# EAGLE design LoRa Gateway ESP32 - DRAFT 3 (EAGLE 9.4.2)
COMPANY: ADAFRUIT INDUSTRIES; DRAWN: KTOWN; REV: B

## Sheet 1 of 2: ESP
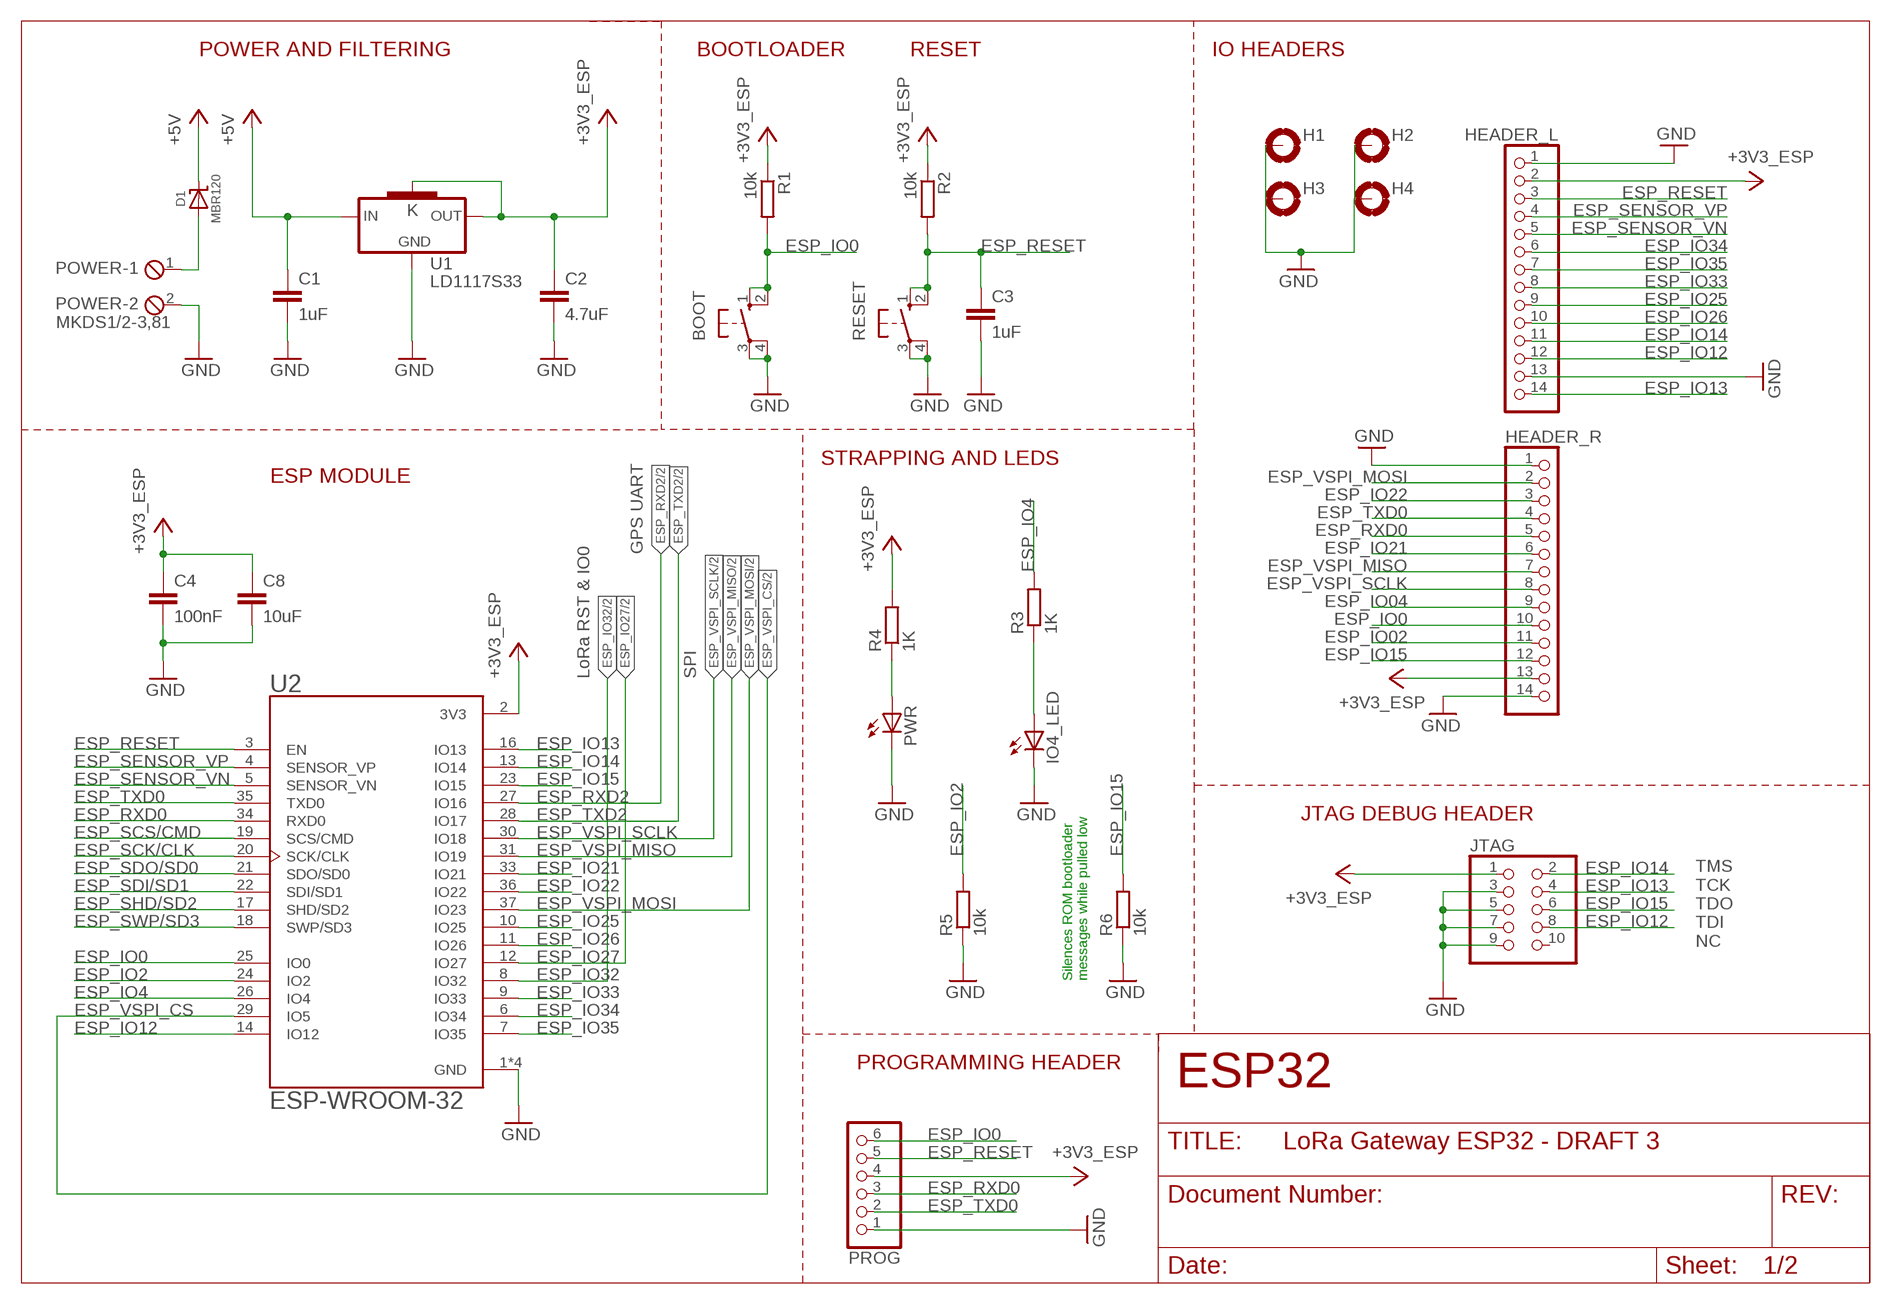
[diagram p0: schematic, sheet 1]

### Parts
BOOT  10-XX  [B3F-10XX]
C1  1uF  C-EUC0805K  [C0805K]
C2  4.7uF  C-EUC0805K  [C0805K]
C3  1uF  C-EUC0805K  [C0805K]
C4  100nF  C-EUC0805K  [C0805K]
C8  10uF  C-EUC0805K  [C0805K]
D1  MBR120  DIODE-SCHOTTKYSOD-123  [SOD-123]
H1  MOUNT-PAD-ROUND3.2  [3,2-PAD]
H2  MOUNT-PAD-ROUND3.2  [3,2-PAD]
H3  MOUNT-PAD-ROUND3.2  [3,2-PAD]
H4  MOUNT-PAD-ROUND3.2  [3,2-PAD]
HEADER_L  PINHD-1X14  [1X14]
HEADER_R  PINHD-1X14  [1X14]
IO4_LED  LEDCHIP-LED0805  [CHIP-LED0805]
JTAG  PINHD-2X5  [2X05]
POWER  MKDS1/2-3,81  [2POL381]
PROG  PINHD-1X6  [1X06]
PWR  LEDCHIP-LED0805  [CHIP-LED0805]
R1  10k  R-EU_R0805  [R0805]
R2  10k  R-EU_R0805  [R0805]
R3  1K  R-EU_R0805  [R0805]
R4  1K  R-EU_R0805  [R0805]
R5  10k  R-EU_R0805  [R0805]
R6  10k  R-EU_R0805  [R0805]
RESET  10-XX  [B3F-10XX]
U1  LD1117S33  [SOT223]
U2  ESP-WROOM-32  [MODULE_ESP-WROOM-32]

### Nets
+3V3_ESP: C2.1 C4.1 C8.1 HEADER_L.2 HEADER_R.13 JTAG.1 PROG.4 R1.1 R2.1 R4.2 U1.2(OUT) U1.4(K) U2.2(3V3) ; also sheet 2
+5V: C1.1 D1.C U1.3(IN)
ESP_IO0: BOOT.1(S) BOOT.2(S1) HEADER_R.10 PROG.6 R1.2 U2.25(IO0)
ESP_IO2: R5.2 U2.24(IO2)
ESP_IO02: HEADER_R.11
ESP_IO4: R3.2 U2.26(IO4)
ESP_IO04: HEADER_R.9
ESP_IO12: HEADER_L.12 JTAG.8 U2.14(IO12)
ESP_IO13: HEADER_L.14 JTAG.4 U2.16(IO13)
ESP_IO14: HEADER_L.11 JTAG.2 U2.13(IO14)
ESP_IO15: HEADER_R.12 JTAG.6 R6.2 U2.23(IO15)
ESP_IO21: HEADER_R.6 U2.33(IO21)
ESP_IO22: HEADER_R.3 U2.36(IO22)
ESP_IO25: HEADER_L.9 U2.10(IO25)
ESP_IO26: HEADER_L.10 U2.11(IO26)
ESP_IO27: U2.12(IO27) ; also sheet 2
ESP_IO32: U2.8(IO32) ; also sheet 2
ESP_IO33: HEADER_L.8 U2.9(IO33)
ESP_IO34: HEADER_L.6 U2.6(IO34)
ESP_IO35: HEADER_L.7 U2.7(IO35)
ESP_RESET: C3.1 HEADER_L.3 PROG.5 R2.2 RESET.1(S) RESET.2(S1) U2.3(EN)
ESP_RXD0: HEADER_R.5 PROG.3 U2.34(RXD0)
ESP_RXD2: U2.27(IO16) ; also sheet 2
ESP_SCK/CLK: U2.20(SCK/CLK)
ESP_SCS/CMD: U2.19(SCS/CMD)
ESP_SDI/SD1: U2.22(SDI/SD1)
ESP_SDO/SD0: U2.21(SDO/SD0)
ESP_SENSOR_VN: HEADER_L.5 U2.5(SENSOR_VN)
ESP_SENSOR_VP: HEADER_L.4 U2.4(SENSOR_VP)
ESP_SHD/SD2: U2.17(SHD/SD2)
ESP_SWP/SD3: U2.18(SWP/SD3)
ESP_TXD0: HEADER_R.4 PROG.2 U2.35(TXD0)
ESP_TXD2: U2.28(IO17) ; also sheet 2
ESP_VSPI_CS: U2.29(IO5) ; also sheet 2
ESP_VSPI_MISO: HEADER_R.7 U2.31(IO19) ; also sheet 2
ESP_VSPI_MOSI: HEADER_R.2 U2.37(IO23) ; also sheet 2
ESP_VSPI_SCLK: HEADER_R.8 U2.30(IO18) ; also sheet 2
GND: BOOT.3(P) BOOT.4(P1) C1.2 C2.2 C3.2 C4.2 C8.2 H1.B3,2(MOUNT) H2.B3,2(MOUNT) H3.B3,2(MOUNT) H4.B3,2(MOUNT) HEADER_L.1 HEADER_L.13 HEADER_R.1 HEADER_R.14 IO4_LED.C JTAG.3 JTAG.5 JTAG.7 JTAG.9 POWER.2 PROG.1 PWR.C R5.1 R6.1 RESET.3(P) RESET.4(P1) U1.1(GND) U2.1(GND) U2.1.1(GND) U2.15(GND) U2.38(GND) ; also sheet 2
N$2: D1.A POWER.1
N$5: IO4_LED.A R3.1
N$10: PWR.A R4.1
Unconnected: JTAG.10

### Notes on the sheet
- POWER AND FILTERING | BOOTLOADER | RESET | IO HEADERS
- STRAPPING AND LEDS
- ESP MODULE
- GPS UART
- LoRa RST & IO0 | SPI
- JTAG DEBUG HEADER
- TMS
  TCK
  TDO
  TDI
  NC
- Silences ROM bootloader
  messages while pulled low
- PROGRAMMING HEADER
- ESP32

## Sheet 2 of 2: Lora and GPS
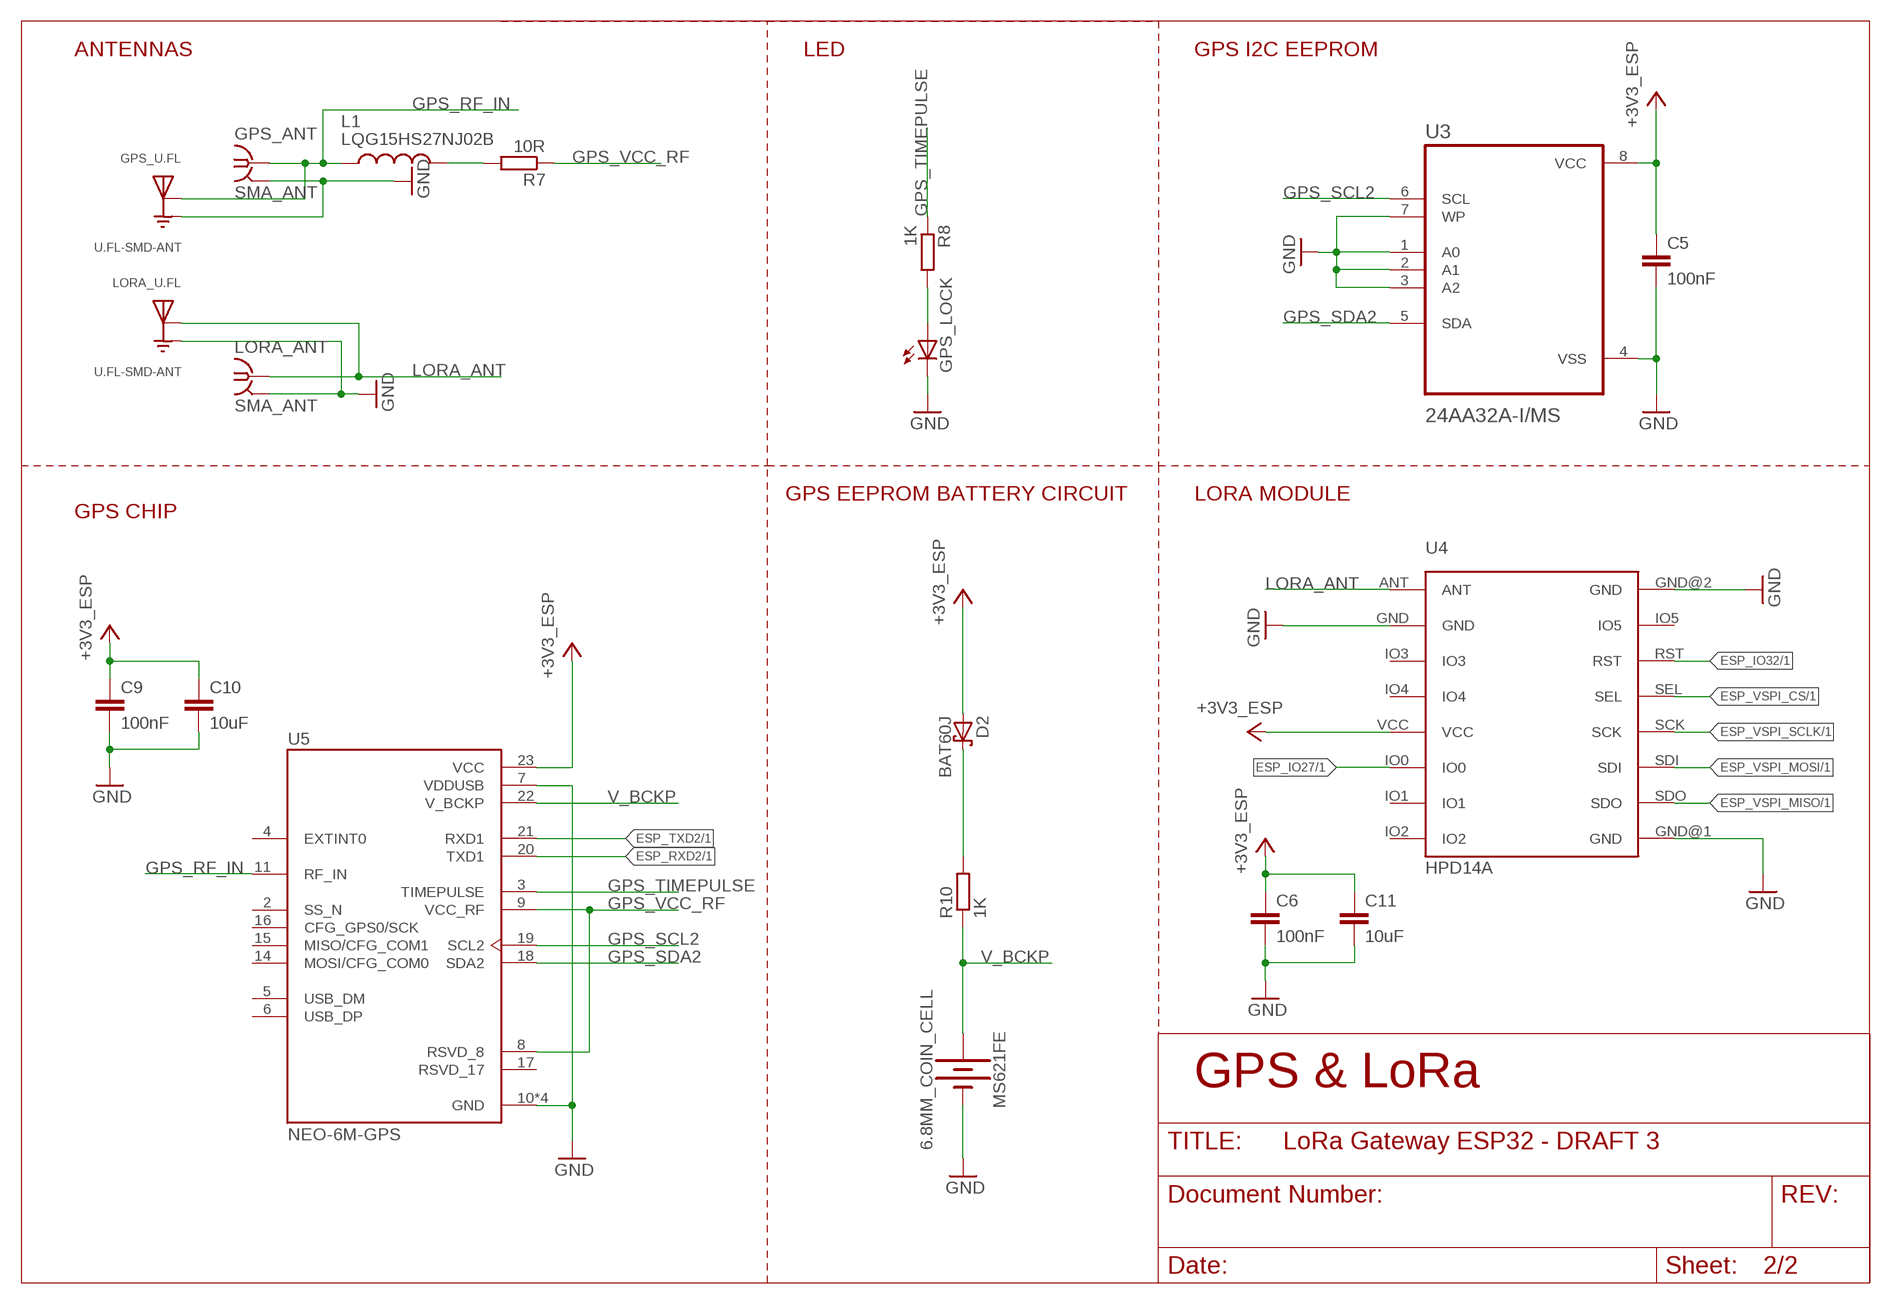
[diagram p1: schematic, sheet 2]

### Parts
C5  100nF  C-EUC0805K  [C0805K]
C6  100nF  C-EUC0805K  [C0805K]
C9  100nF  C-EUC0805K  [C0805K]
C10  10uF  C-EUC0805K  [C0805K]
C11  10uF  C-EUC0805K  [C0805K]
D2  BAT60J  [SOD323_ST]
GPS_ANT  SMA_ANT  [BU-SMA-H]
GPS_LOCK  LEDCHIP-LED0805  [CHIP-LED0805]
GPS_U.FL  U.FL-SMD-ANT  [HRS_U.FL-R-SMT-1(10)]
L1  LQG15HS27NJ02B  [INDC1005X55N]
LORA_ANT  SMA_ANT  [BU-SMA-H]
LORA_U.FL  U.FL-SMD-ANT  [HRS_U.FL-R-SMT-1(10)]
MS621FE  6.8MM_COIN_CELL  BATTERY-6.8MM_SMD  [BATTCON-6.8MM]
R7  10R  R-EU_R0805  [R0805]
R8  1K  R-EU_R0805  [R0805]
R10  1K  R-EU_R0805  [R0805]
U3  24AA32A-I/MS  [SOP65P490X110-8N]
U4  HPD14A  [HPD14A]
U5  NEO-6M-GPS  [XCVR_NEO-6M-GPS]

### Nets
+3V3_ESP: C5.1 C6.1 C9.1 C10.1 C11.1 D2.A U3.8(VCC) U4.VCC U5.23(VCC) ; also sheet 1
ESP_IO27: U4.IO0 ; also sheet 1
ESP_IO32: U4.RST ; also sheet 1
ESP_RXD2: U5.20(TXD1) ; also sheet 1
ESP_TXD2: U5.21(RXD1) ; also sheet 1
ESP_VSPI_CS: U4.SEL ; also sheet 1
ESP_VSPI_MISO: U4.SDO ; also sheet 1
ESP_VSPI_MOSI: U4.SDI ; also sheet 1
ESP_VSPI_SCLK: U4.SCK ; also sheet 1
GND: C5.2 C6.2 C9.2 C10.2 C11.2 GPS_ANT.2 GPS_ANT.3 GPS_ANT.4 GPS_ANT.5 GPS_LOCK.C GPS_U.FL.1(GND) GPS_U.FL.3(GND) LORA_ANT.2 LORA_ANT.3 LORA_ANT.4 LORA_ANT.5 LORA_U.FL.1(GND) LORA_U.FL.3(GND) MS621FE.- U3.1(A0) U3.2(A1) U3.3(A2) U3.4(VSS) U3.7(WP) U4.GND U4.GND@1(GND) U4.GND@2(GND) U5.7(VDDUSB) U5.10(GND) U5.12(GND) U5.13(GND) U5.24(GND) ; also sheet 1
GPS_RF_IN: GPS_ANT.1 GPS_U.FL.2(SIG) L1.1 U5.11(RF_IN)
GPS_SCL2: U3.6(SCL) U5.19(SCL2)
GPS_SDA2: U3.5(SDA) U5.18(SDA2)
GPS_TIMEPULSE: R8.1 U5.3(TIMEPULSE)
GPS_VCC_RF: R7.1 U5.8(RSVD_8) U5.9(VCC_RF)
LORA_ANT: LORA_ANT.1 LORA_U.FL.2(SIG) U4.ANT
N$14: GPS_LOCK.A R8.2
N$16: L1.2 R7.2
N$17: D2.C R10.2
V_BCKP: MS621FE.+ R10.1 U5.22(V_BCKP)
Unconnected: U4.IO1 U4.IO2 U4.IO3 U4.IO4 U4.IO5 U5.2(SS_N) U5.4(EXTINT0) U5.5(USB_DM) U5.6(USB_DP) U5.14(MOSI/CFG_COM0) U5.15(MISO/CFG_COM1) U5.16(CFG_GPS0/SCK) U5.17(RSVD_17)

### Notes on the sheet
- ANTENNAS | LED | GPS I2C EEPROM
- GPS EEPROM BATTERY CIRCUIT | LORA MODULE
- GPS CHIP
- GPS & LoRa

## Library data of the parts
BOOT RESET = LoRa Gateway ESP32 - DRAFT 2 VARIANT 2:10-XX: OMRON SWITCH; MPN: B3F-1000; OC_FARNELL: 176432; OC_NEWARK: 36M3542
C1-C6 C8-C11 = LoRa Gateway ESP32 - DRAFT 2 VARIANT 2:C-EU: CAPACITOR, European symbol
D1 = LoRa Gateway ESP32 - DRAFT 2 VARIANT 2:DIODE-SCHOTTKY
D2 = LoRa Gateway ESP32 - DRAFT 2 VARIANT 2:BAT60J: Schottky barrier diode Source: www.st.com, BAT60J.pdf
GPS_ANT LORA_ANT = LoRa Gateway ESP32 - DRAFT 2 VARIANT 2:SMA_ANT: FEMALE SMA CONNECTOR Radiall; OC_FARNELL: unknown; OC_NEWARK: unknown
GPS_LOCK IO4_LED PWR = LoRa Gateway ESP32 - DRAFT 2 VARIANT 2:LED: LED OSRAM: - CHIPLED LG R971, LG N971, LY N971, LG Q971, LY Q971, LO R971, LY R971 LH N974, LH R974 LS Q976, LO Q976, LY Q976 LO Q996 - Hyper CHIPLED LW Q18S LB Q993, LB Q99A, LB R99A - SideLED LS A670, LO A670, LY A670, LG A670, LP A670 LB A673, LV A673, LT A673, LW A673 LH A674 LY A675 LS A676, LA A676, LO A676, LY A676, LW A676 LS A679, LY A679, LG A679 - Hyper Micro SIDELED® LS Y876, LA Y876, LO Y876, LY Y876 LT Y87S - SmartLED LW L88C, LW L88S LB L89C, LB L89S, LG L890 LS L89K, LO L89K, LY L89K LS L896, LA L896, LO L896, LY L896 - TOPLED LS T670, LO T670, LY T670, LG T670, LP T670 LSG T670, LSP T670, LSY T670, LOP T670, LYG T670 LG T671, LOG T671, LSG T671 LB T673, LV T673, LT T673, LW T673 LH T674 LS T676, LA T676, LO T676, LY T676, LB T676, LH T676, LSB T676, LW T676 LB T67C, LV T67C, LT T67C, LS T67K, LO T67K, LY T67K, LW E67C LS E67B, LA E67B, LO E67B, LY E67B, LB E67C, LV E67C, LT E67C LW T67C LS T679, LY T679, LG T679 LS T770, LO T770, LY T770, LG T770, LP T770 LB T773, LV T773, LT T773, LW T773 LH T774 LS E675, LA E675, LY E675, LS T675 LS T776, LA T776, LO T776, LY T776, LB T776 LHGB T686 LT T68C, LB T68C - Hyper Mini TOPLED® LB M676 - Mini TOPLED Santana® LG M470 LS M47K, LO M47K, LY M47K Source: http://www.osram.convergy.de LUXEON: - LUMILED® LXK2-PW12-R00, LXK2-PW12-S00, LXK2-PW14-U00, LXK2-PW14-V00 LXK2-PM12-R00, LXK2-PM12-S00, LXK2-PM14-U00 LXK2-PE12-Q00, LXK2-PE12-R00, LXK2-PE12-S00, LXK2-PE14-T00, LXK2-PE14-U00 LXK2-PB12-K00, LXK2-PB12-L00, LXK2-PB12-M00, LXK2-PB14-N00, LXK2-PB14-P00, LXK2-PB14-Q00 LXK2-PR12-L00, LXK2-PR12-M00, LXK2-PR14-Q00, LXK2-PR14-R00 LXK2-PD12-Q00, LXK2-PD12-R00, LXK2-PD12-S00 LXK2-PH12-R00, LXK2-PH12-S00 LXK2-PL12-P00, LXK2-PL12-Q00, LXK2-PL12-R00 Source: www.luxeon.com KINGBRIGHT: KA-3528ASYC Source: www.kingbright.com
GPS_U.FL LORA_U.FL = LoRa Gateway ESP32 - DRAFT 2 VARIANT 2:U.FL-SMD-ANT: U.FL Series 6 Ghz 50 Ohm Ultra-small SMT Coaxial Cable Receptacle Check prices <https://pricing.snapeda.com/parts/U.FL-R-SMT-1%2810%29/Hirose/view-part?ref=eda>; AVAILABILITY: Warning; DESCRIPTION: U.FL (UMCC) Connector Receptacle, Male Pin 50Ohm Surface Mount Solder; MF: Hirose; MP: U.FL-R-SMT-1(10); PACKAGE: None; PRICE: None; PURCHASE-URL: https://pricing.snapeda.com/search/part/U.FL-R-SMT-1(10)/?ref=eda
H1-H4 = holes:MOUNT-PAD-ROUND: MOUNTING PAD, round
HEADER_L HEADER_R = LoRa Gateway ESP32 - DRAFT 2 VARIANT 2:PINHD-1X14: PIN HEADER
JTAG = LoRa Gateway ESP32 - DRAFT 2 VARIANT 2:PINHD-2X5: PIN HEADER
L1 = LoRa Gateway ESP32 - DRAFT 2 VARIANT 2:LQG15HS27NJ02B; AVAILABILITY: Unavailable; DESCRIPTION: Inductor with Inductance: 27nH Tol. +/-5%, Package: 0402 (1005); MF: Murata; MP: LQG15HS27NJ02B; PACKAGE: 1005 Murata; PRICE: None
MS621FE = LoRa Gateway ESP32 - DRAFT 2 VARIANT 2:BATTERY: Battery - Single Cell A variety of battery chemistries, sizes, and footprints. Device List: 20MM_PTH - Coin Cell Battery Holder - 20mm (PTH) <https://www.sparkfun.com/products/783> 20MM_PTH_KIT- Coin Cell battery Holder - 20 mm (PTH) <http://www.sparkfun.com/products/783>kit version with special mask 6.8MM_PTH - Coin Cell Battery Holder - 6.8MM(SMD) <https://www.digikey.com/product-detail/en/seiko-instruments/MS621FE-FL11E/728-1057-ND/1889208?WT.srch=1&gclid=CNOQ5a6LzdQCFZS2wAodXCkE0g> 12MM_SMD - Coin Cell Battery Holder - 12mm (SMD) <https://www.sparkfun.com/products/10592> 12MM_PTH - Coin Cell Battery Holder - 12mm (PTH) <https://www.sparkfun.com/products/7948> 20MM_SMD - 20mm Coin Cell Battery Holder (SMD) (2 legs) Used on the Big Time Watch Kit <https://www.sparkfun.com/products/11734> 20MM_SMD_4LEGS - Coin Cell Battery Holder - 20mm (SMD) <https://www.sparkfun.com/products/11892> 20MM_SMD_4LEGS_OVERPASTE - Coin Cell Battery Holder - 20mm (SMD) <https://www.sparkfun.com/products/11892> (Over-paste on the legs) 24.5MM_PTH - Coin Cell Battery Holder - 24.5mm (PTH) <https://www.sparkfun.com/products/8863> 9V - 9V Battery Holder - PC Mount Used on the SparkFun SparkPunk Sound Kit <https://www.sparkfun.com/products/11177> and SparkFun SparkPunk Sequencer Kit <https://www.sparkfun.com/products/12707> 18650 - Battery Holder - 18650 (PTH) <https://www.sparkfun.com/products/13113> AA - Battery Holder - 1xAA (PTH) <https://www.sparkfun.com/products/7949> AAA - Battery Holder - 1xAAA (PTH) <https://www.sparkfun.com/products/12718> AA_KIT - Battery Holder - 1xAA (PTH) <https://www.sparkfun.com/products/7949> Special kit package - pads only have exposed copper on one side of the board. AAA_KIT - Battery Holder - 1xAAA (PTH) <https://www.sparkfun.com/products/12718> Special kit package - pads only have exposed copper on one side of the board.; PROD_ID: BATT-13734
POWER = LoRa Gateway ESP32 - DRAFT 2 VARIANT 2:MKDS1/2-3,81: MKDS 1/2-3,81 - Order No. 1727010 (RS-Online - 101-5384) Pitch: 3,81mm Number of terminals: 2 Rated Voltage: 160V Maximum load current/ cross section: 12A/1.5mm2-AWG16 Housing Interlocking: none Color: Green
PROG = LoRa Gateway ESP32 - DRAFT 2 VARIANT 2:PINHD-1X6: PIN HEADER
R1-R8 R10 = LoRa Gateway ESP32 - DRAFT 2 VARIANT 2:R-EU_: RESISTOR, European symbol
U1 = LoRa Gateway ESP32 - DRAFT 2 VARIANT 2:LD1117S33: VOLTAGE REGULATOR SMD 3,3V; AVAILABILITY: Unavailable; DESCRIPTION: Linear Voltage Regulator IC 1 Output 800mA SOT-223; MF: STMicroelectronics; MP: LD1117S33; PACKAGE: TO-261-4 STMicroelectronics; PRICE: None
U2 = LoRa Gateway ESP32 - DRAFT 2 VARIANT 2:ESP-WROOM-32: Module: combo; GPIO, I2C x2, I2S x2, SDIO, SPI x3, UART x3; 19.5dBm Check prices <https://pricing.snapeda.com/parts/ESP-WROOM-32/Olimex%20LTD/view-part?ref=eda>; AVAILABILITY: Bad; DESCRIPTION: WiFi 802.11b/g/n/d/e/i Transceiver Module 2.4GHz Surface Mount; MF: Olimex LTD; MP: ESP-WROOM-32; PACKAGE: Module Olimex LTD; PRICE: None
U3 = LoRa Gateway ESP32 - DRAFT 2 VARIANT 2:24AA32A-I/MS; AVAILABILITY: Unavailable; DESCRIPTION: EEPROM Memory IC 32Kb (4K x 8) I²C 400kHz 900ns 8-MSOP; MF: Microchip; MP: 24AA32A-I/MS; PACKAGE: MSOP-8 Microchip; PRICE: None
U4 = LoRa Gateway ESP32 - DRAFT 2 VARIANT 2:HPD14A: LoRa SX1278 module HPD14A
U5 = LoRa Gateway ESP32 - DRAFT 2 VARIANT 2:NEO-6M-GPS: SMD GPS Module; AVAILABILITY: Unavailable; DESCRIPTION: SMD GPS Module;; MF: u-blox; MP: NEO-6M-GPS; PACKAGE: None; PRICE: None

## Board
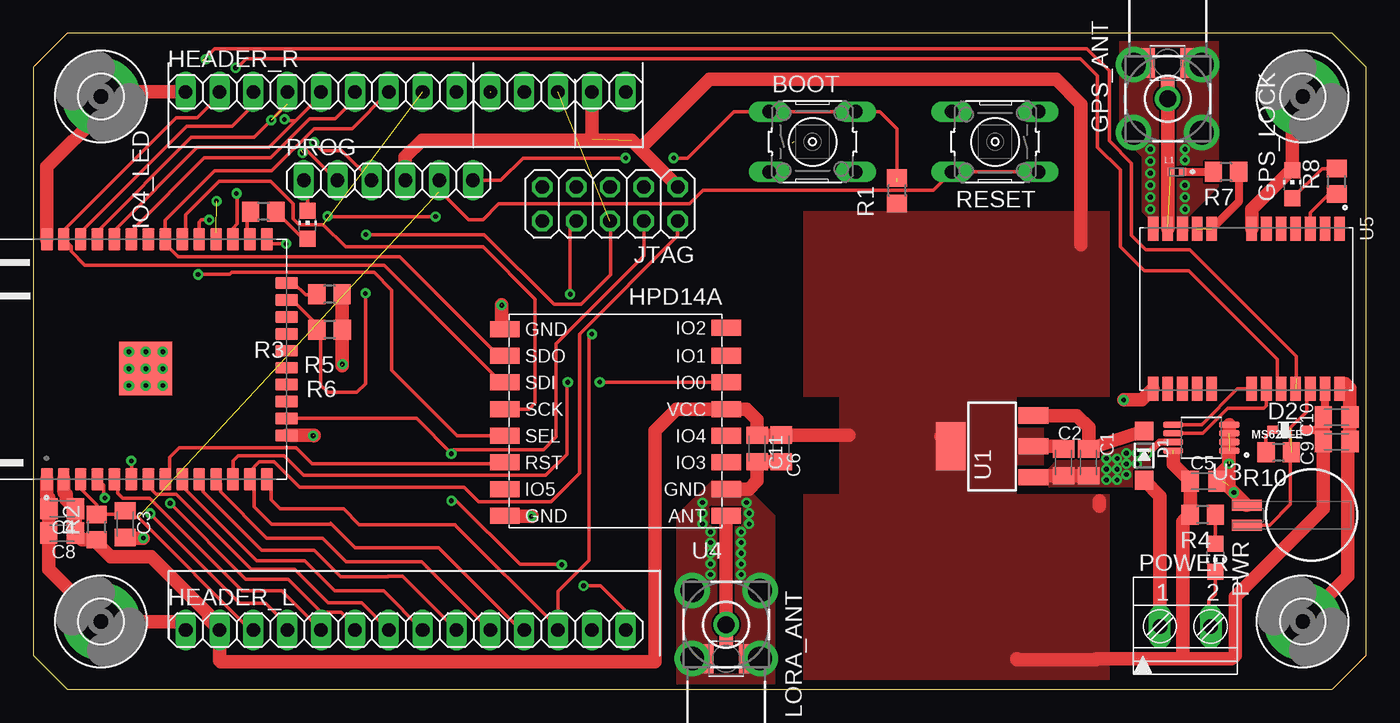
[diagram p2: board, top side]
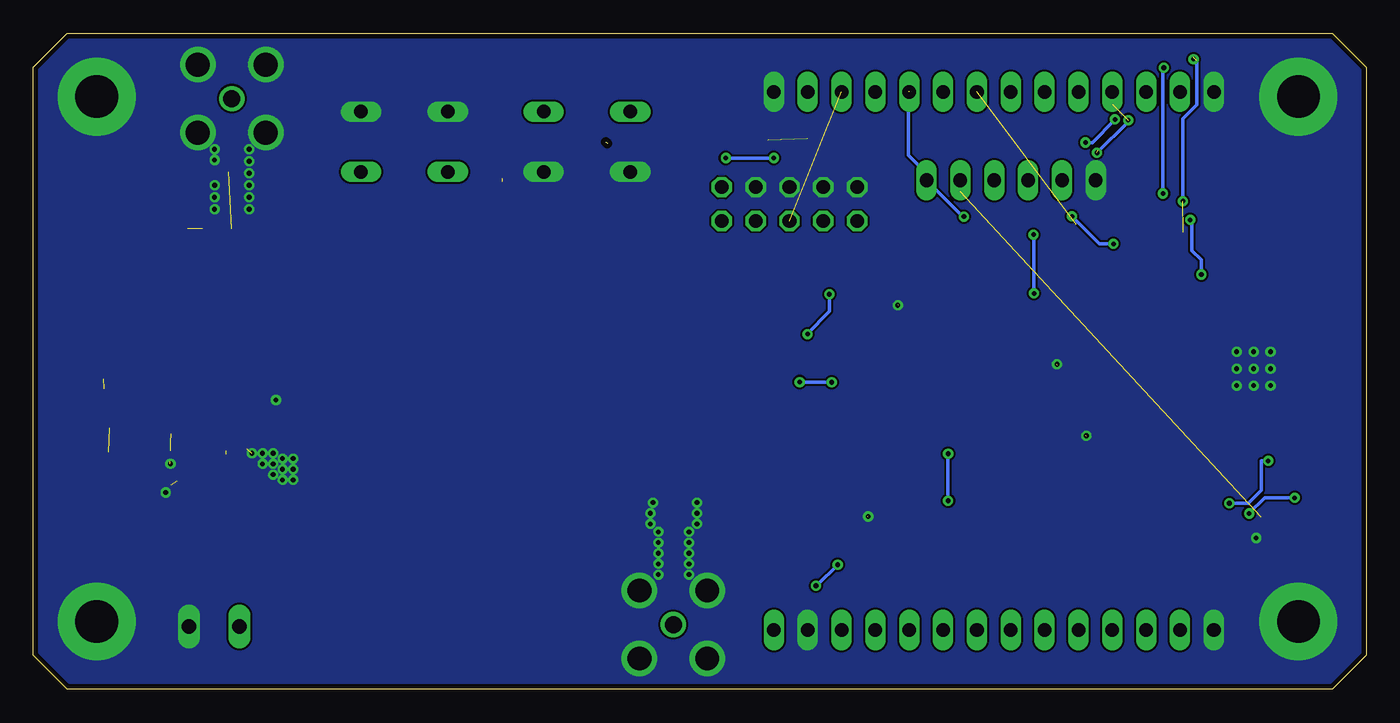
[diagram p3: board, bottom side, seen from below]

Size 100 x 49.2 mm. Coordinates in mm from the lower left corner, seen from the top.
Outline: 57.05,41.06 56.93,40.94
Outline: 2.54,0 97.46,0 100,2.54 100,46.66 97.46,49.2 2.54,49.2 0,46.66 0,2.54 2.54,0
Copper layers (1*16): Top 0.035mm / dielectric 1.5mm / Bottom 0.035mm
Design rules "default *": minimum track width 6mil, minimum drill 0.35mm, track to track 6mil, track to pad 6mil, pad to pad 6mil, via to via 6mil, smd to smd 6mil, copper to edge 15mil, drill to drill 6mil, minimum pad ring 10mil, minimum via ring 8mil, stop-mask expansion 4mil, vias tented up to drill 0mil, thermal gap 10mil

### Footprints (pad centres in the part's own frame; a part is rotated, then mirrored left to right if it is on the bottom)
B3F-10XX = drill 1.016 long: 1 -3.251,2.261; 2 3.251,2.261; 3 -3.251,-2.261; 4 3.251,-2.261
C0805K = smd 1.3 x 1.6: 1 -1,0; 2 1,0
SOD-123 = smd 1.4 x 1.4: A 1.85,0; C -1.85,0
SOD323_ST = smd 0.8 x 0.6: A 1.25,0; C -1.25,0
BU-SMA-H = drill 1.27: 1 0,0 | drill 1.778: 2 -2.55,2.55; 3 2.55,2.55; 4 2.55,-2.55; 5 -2.55,-2.55
CHIP-LED0805 = smd 1.2 x 1.2: A 0,-1.05; C 0,1.05
HRS_U.FL-R-SMT-1(10) = smd 1.05 x 2.2: 1 -1.475,0; 3 1.475,0 | smd 1 x 1.05: 2 0,-1.525
3,2-PAD = drill 3.2 pad 5.842: B3,2 0,0
1X14 = drill 1.016 long: 1 -16.51,0; 2 -13.97,0; 3 -11.43,0; 4 -8.89,0; 5 -6.35,0; 6 -3.81,0; 7 -1.27,0; 8 1.27,0; 9 3.81,0; 10 6.35,0; 11 8.89,0; 12 11.43,0; 13 13.97,0; 14 16.51,0
2X05 = drill 1.016 octagon: 1 -5.08,-1.27; 2 -5.08,1.27; 3 -2.54,-1.27; 4 -2.54,1.27; 5 0,-1.27; 6 0,1.27; 7 2.54,-1.27; 8 2.54,1.27; 9 5.08,-1.27; 10 5.08,1.27
INDC1005X55N = smd 0.54 x 0.6: 1 -0.432,0; 2 0.432,0
BATTCON-6.8MM = smd 2.25 x 0.85: + 4.87,0.75; - 4.87,-0.75
2POL381 = drill 1.1 long: 1 0,0; 2 3.81,0
1X06 = drill 1.016 long: 1 -6.35,0; 2 -3.81,0; 3 -1.27,0; 4 1.27,0; 5 3.81,0; 6 6.35,0
R0805 = smd 1.3 x 1.5: 1 -0.95,0; 2 0.95,0
SOT223 = smd 1.219 x 2.235: 1 -2.311,-3.099; 2 0,-3.099; 3 2.311,-3.099 | smd 3.6 x 2.2: 4 0,3.099
MODULE_ESP-WROOM-32 = smd 1.7 x 0.9: 1 -9,8.255; 2 -9,6.985; 3 -9,5.715; 4 -9,4.445; 5 -9,3.175; 6 -9,1.905; 7 -9,0.635; 8 -9,-0.635; 9 -9,-1.905; 10 -9,-3.175; 11 -9,-4.445; 12 -9,-5.715; 13 -9,-6.985; 14 -9,-8.255; 25 9,-8.255; 26 9,-6.985; 27 9,-5.715; 28 9,-4.445; 29 9,-3.175; 30 9,-1.905; 31 9,-0.635; 32 9,0.635; 33 9,1.905; 34 9,3.175; 35 9,4.445; 36 9,5.715; 37 9,6.985; 38 9,8.255 | smd 4 x 4: 1.1 -0.7,0.845 | smd 0.9 x 1.7: 15 -5.715,-9.755; 16 -4.445,-9.755; 17 -3.175,-9.755; 18 -1.905,-9.755; 19 -0.635,-9.755; 20 0.635,-9.755; 21 1.905,-9.755; 22 3.175,-9.755; 23 4.445,-9.755; 24 5.715,-9.755
SOP65P490X110-8N = smd 1.5 x 0.49: 1 -2.105,0.975; 2 -2.105,0.325; 3 -2.105,-0.325; 4 -2.105,-0.975; 5 2.105,-0.975; 6 2.105,-0.325; 7 2.105,0.325; 8 2.105,0.975
HPD14A = smd 2.2 x 1.2: ANT -7.9,6.9; GND -7.9,4.9; GND@1 8.7,-7.1; GND@2 8.7,6.9; IO0 -7.9,-3.1; IO1 -7.9,-5.1; IO2 -7.9,-7.2; IO3 -7.9,2.9; IO4 -7.9,0.9; IO5 8.7,4.9; RST 8.7,2.9; SCK 8.7,-1.1; SDI 8.7,-3.1; SDO 8.7,-5.1; SEL 8.7,0.9; VCC -7.9,-1.1
XCVR_NEO-6M-GPS = smd 1.8 x 0.8: 1 -6,7; 2 -6,5.9; 3 -6,4.8; 4 -6,3.7; 5 -6,2.6; 6 -6,1.5; 7 -6,0.4; 8 -6,-2.6; 9 -6,-3.7; 10 -6,-4.8; 11 -6,-5.9; 12 -6,-7; 13 6,-7; 14 6,-5.9; 15 6,-4.8; 16 6,-3.7; 17 6,-2.6; 18 6,0.4; 19 6,1.5; 20 6,2.6; 21 6,3.7; 22 6,4.8; 23 6,5.9; 24 6,7

### Placement (x,y rotation side)
BOOT  58.46,41.06 0 top
C1  79.17,17.02 270 top
C2  77.29,17.02 270 top
C3  6.89,12.39 270 top
C4  2.15,13.54 180 top
C5  87.8,15.6 0 top
C6  56.1,18.07 270 top
C8  2.15,11.71 180 top
C9  97.78,18.58 0 top
C10  97.78,20.42 0 top
C11  54.3,18.06 270 top
D1  83.34,17.53 270 top
D2  94.24,19.47 0 top
GPS_ANT  85.11,44.3 90 top
GPS_LOCK  94.47,37.87 0 top
GPS_U.FL  85.11,46.97 0 top
H1  5.07,44.45 90 top
H2  5.07,5.08 90 top
H3  95.24,5.08 90 top
H4  95.24,44.45 90 top
HEADER_L  27.93,4.44 0 top
HEADER_R  27.93,44.81 0 top
IO4_LED  20.56,34.86 0 top
JTAG  43.26,36.39 180 top
L1  85.77,38.81 0 top
LORA_ANT  51.97,4.85 270 top
LORA_U.FL  51.97,2.29 180 top
MS621FE  95.9,13.06 180 top
POWER  84.52,4.72 0 top
PROG  26.63,38.18 0 top
PWR  88.68,9.87 180 top
R1  64.81,37.4 90 top
R2  4.75,12.17 90 top
R3  17.25,35.84 180 top
R4  87.74,13.09 180 top
R5  22.22,29.62 180 top
R6  22.22,26.97 180 top
R7  89.48,38.81 180 top
R8  97.78,38.1 90 top
R10  93.43,17.76 180 top
RESET  72.15,41.06 180 top
U1  71.93,18.22 90 top
U2  9.26,24.75 90 top
U3  87.62,18.87 180 top
U4  44.07,19.92 180 top
U5  91,28.53 270 top

### Tracks (layer width: path | path; a pad name or v marks a point on that pad's centre or on a via)
+3V3_ESP  (2 unrouted)
  Top 0.254: 96.74,19.47 96.78,19.51
  Top 0.61: U5.23 96.9,20.54 | D2.A 96.74,19.47
  Top 1.016: U1.2 77.09,18.22 C2.1 | 85.52,17.64 85.52,16.88 C5.1 86.79,15.59 R4.2 86.26,12.56 86.26,2.28 | 80,14.13 80,13.73 | 96.9,20.54 C10.1 96.78,19.51 C9.1 96.78,13.54 90.18,6.95 90.18,2.56 89.9,2.28 86.26,2.28 | 61.18,19.06 C6.1 C11.1 54.3,20.23 53.51,21.02 U4.VCC 48.24,21.02 46.62,19.4 46.62,2.06 14.04,2.06 13.96,2.14 HEADER_L.2 | U1.4 68.08,18.98 | HEADER_L.2 13.94,4.44 | U2.2 2.27,14.9 2.32,14.86 2.32,14.76 2.46,14.62 2.46,14.23 C4.1 C8.1 3.64,11.22 R2.1 4.75,11 5.8,9.95 8.84,9.95 13.15,5.64 13.15,5.24 HEADER_L.2 | 41.9,41.27 HEADER_R.13 | PROG.4 27.9,39.94 29.15,41.19 44.89,41.19 45.52,40.56 | 45.52,40.56 50.71,45.75 76.74,45.75 78.59,43.9 78.59,33.35 | JTAG.1 48.34,37.73 45.52,40.56 | 73.81,2.28 73.81,2.21 79.71,2.21 79.78,2.28 86.26,2.28
  pour Top (isolate 0.254, no thermals): 57.81,14.62 60.51,14.62 60.51,21.94 57.81,21.94 57.81,35.84 80.7,35.84 80.7,21.93 73.71,21.93 73.71,19.71 75.78,19.71 75.78,16.66 73.71,16.66 73.71,14.61 80.71,14.61 80.71,0.72 57.81,0.72
+5V
  Top 1.016: D1.C C1.1 | C1.1 | U1.3 78.29,20.53 79.18,19.65 C1.1
ESP_IO0  (via drill 0.35)  (2 unrouted)
  Top 0.254: PROG.6 35.05,38.18 36.72,39.85 v44.44,39.85 | 64.22,37.89 64.8,38.06 64.8,42.05 63.52,43.33 BOOT.2 BOOT.1 52.55,43.33 49.08,39.85 v48.04,39.85 | U2.25 17.86,33.41 v18.95,33.41 | v30.17,35.45 22.1,35.45 22.07,35.48 v22.06,35.47
  Bottom 0.254: v48.04,39.85 v44.44,39.85 | v44.44,39.85 | v30.17,35.45 30.27,35.45 30.33,35.5 30.33,35.53 PROG.6 32.98,39.07 33.15,39.24 33.51,39.24 34.34,40.07 34.34,44.81 | v22.06,35.47 20,33.41 v18.95,33.41
ESP_IO2
  Top 0.254: U2.24 19.53,30.47 20.41,29.59 21.24,29.59 R5.2
ESP_IO4
  Top 0.254: R3.2 16.05,35.58 16.05,33.95 U2.26
ESP_IO12  (via drill 0.35)
  Top 0.254: U2.14 17.84,15.43 17.84,14.2 18.51,13.53 23.27,13.53 24.45,12.35 31.63,12.35 31.62,12.34 39.36,4.6 HEADER_L.12 39.36,7.33 41.69,9.66 41.69,26.43 v41.9,26.64 | v40.27,29.63 40.27,34.67 JTAG.8
  Bottom 0.254: v40.27,29.63 40.25,28.35 41.93,26.67 v41.9,26.64
ESP_IO13  (via drill 0.35)
  Top 0.254: 19.02,20.32 U2.16 28.75,20.31 31.38,17.68 v31.35,17.66 31.35,17.8 31.52,17.97 38.26,17.97 39.21,18.92 39.21,25.92 45.8,32.51 JTAG.4 | v31.36,14.14 31.73,14.14 36.5,9.37 39.64,9.37 v39.64,9.34 | v41.28,7.76 42.55,7.76 44.44,5.87 HEADER_L.14
  Bottom 0.254: v31.36,14.14 31.36,14.21 v31.36,17.65 v31.35,17.66 | v39.64,9.34 41.19,7.79 41.28,7.79 v41.28,7.76
ESP_IO14
  Top 0.254: HEADER_L.11 36.59,4.44 30.39,10.63 24.13,10.63 22.31,12.45 22.26,12.39 17.88,12.39 16.57,13.71 16.57,15.43 U2.13 16.24,16.35 16.95,17.06 18.04,17.06 19.96,15.14 32.31,15.14 33.39,14.06 38.84,14.06 40.97,16.2 40.97,26.64 48.34,34.01 JTAG.2
ESP_IO15  (via drill 0.35)  (1 unrouted)
  Top 0.254: U2.23 19.42,29.2 21.46,27.16 21.25,26.96 21.26,26.96 R6.2 21.56,26.69 21.56,22.81 22.1,22.27 24.25,22.27 24.91,22.93 v24.91,29.69 24.91,29.8 | v24.95,34.1 33.82,34.1 39.06,28.87 41.09,28.87 43.32,31.09 43.32,35.07 JTAG.6
  Bottom 0.254: v24.91,29.69 24.91,34.02 24.97,34.08 v24.95,34.1
ESP_IO21
  Top 0.254: U2.33 7.58,33.98 7.58,34.63 12.81,39.87 17.79,39.87 20.72,42.79 22.63,42.79 24.12,44.28 HEADER_R.6
ESP_IO22
  Top 0.254: U2.36 3.7,33.91 3.7,34.43 11.51,42.23 14.92,42.23 16.5,43.81 HEADER_R.3
ESP_IO25
  Top 0.254: U2.10 12.74,15.45 12.74,14.82 17.13,10.43 21.07,10.43 23.06,8.44 26.6,8.44 26.63,8.47 27.71,8.47 HEADER_L.9
ESP_IO26
  Top 0.254: U2.11 14.03,15.43 14.03,14.81 17.49,11.34 21.69,11.34 23.45,9.58 29.14,9.58 HEADER_L.10
ESP_IO27  (via drill 0.35)
  Top 0.254: U2.12 14.98,17.13 15.38,17.53 18.78,17.53 | U4.IO0 42.35,23.02 42.32,23.05 v42.49,23.05 v42.49,23.04 | v40.09,23.03 40.02,22.96 40.02,17.63 38.43,16.03 20.29,16.03 18.79,17.53 18.78,17.53 | 18.78,17.53 18.79,17.52
  Bottom 0.254: v42.49,23.04 40.15,23.04 40.14,23.03 v40.09,23.03
ESP_IO32
  Top 0.254: U2.8 10.21,16.07 10.21,17.39 10.94,18.12 19.69,18.12 20.9,16.92 35.27,16.92 U4.RST 35.19,16.84 34.88,16.84
ESP_IO33
  Top 0.254: U2.9 11.46,15.46 11.46,14.94 16.75,9.64 20.34,9.64 22.59,7.39 22.59,7.37 26.27,7.37 HEADER_L.8
ESP_IO34  (via drill 0.35)
  Top 0.254: U2.6 7.35,17.04 7.34,17.05 v7.34,17.13 | v10.25,13.95 15.94,8.27 19.1,8.27 21.6,5.77 23.09,5.77 24.12,4.73 HEADER_L.6
  Bottom 0.254: v7.34,17.13 7.85,17.13 7.85,14.94 8.83,13.96 v10.25,13.96 v10.25,13.95
ESP_IO35
  Top 0.254: U2.7 8.96,15.42 8.96,14.89 9.23,14.62 10.71,14.62 16.35,8.99 19.6,8.99 22.1,6.49 24.61,6.49 HEADER_L.7
ESP_RESET  (1 unrouted)
  Top 0.254: 3.55,15.22 U2.3 3.55,15.05 4.75,13.84 R2.2 6.62,13.12 C3.1 7.37,12.9 7.85,12.9 16.31,4.44 HEADER_L.3 | 30.44,37.3 PROG.5 30.44,37.43 32.64,35.23 33.73,35.23 34.9,36.41 49.24,36.41 50.25,37.42 67.51,37.42 RESET.2 RESET.1
ESP_RXD0  (via drill 0.35)
  Top 0.254: U2.34 6.09,34.44 12.29,40.65 17.67,40.65 19.68,42.66 | HEADER_R.5 21.58,44.55 19.68,42.66 | PROG.3 23.13,40.41 21.66,40.41 v21.05,41.01 | 19.68,42.66 | 19.68,42.66 18.82,42.66 18.74,42.74 v18.83,42.74
  Bottom 0.254: v18.83,42.74 18.83,42.72 20.54,41.01 v21.05,41.01
ESP_RXD2  (via drill 0.35)
  Top 0.254: U5.20 93.32,22.81 93.32,24.75 86.69,31.39 83.34,31.39 81.54,33.2 81.54,38.95 79.82,40.66 79.82,46.02 78.54,47.3 15.96,47.3 15.27,46.61 v15.18,46.61 | U2.27 14.98,34.58 15.3,34.9 15.3,37.1 15.2,37.2 v15.22,37.2 v15.23,37.19
  Bottom 0.254: v15.23,37.19 15.23,46.55 v15.18,46.61
ESP_SENSOR_VN
  Top 0.254: U2.5 6.34,15.5 6.34,14.7 6.7,14.34 8.73,14.34 15.67,7.39 18.63,7.39 HEADER_L.5
ESP_SENSOR_VP  (via drill 0.35)
  Top 0.254: 4.89,15.67 U2.4 5.28,15.29 5.28,14.44 v5.35,14.36 | v8.77,13.18 15.49,6.47 17.42,6.47 19.04,4.85 HEADER_L.4
  Bottom 0.254: v5.35,14.36 7.61,14.36 v8.78,13.19 v8.77,13.18 | v8.77,13.18
ESP_TXD0  (via drill 0.35)  (2 unrouted)
  Top 0.254: U2.35 4.82,34.36 11.85,41.39 16.55,41.39 19.04,43.89 HEADER_R.4 | PROG.2 22.75,38.18 20.5,40.44 20.13,40.44 | v17.84,42.7 | v17.84,42.7 17.81,42.72
  Bottom 0.254: v17.84,42.7 17.84,42.58 v20.19,40.24
ESP_TXD2  (via drill 0.35)  (4 unrouted)
  Top 0.254: U5.21 94.7,21.94 | U2.28 13.7,34.3 | v12.94,47.27 12.94,47.4 13.6,48.06 79.05,48.06 80.72,46.38 80.72,41.13 82.39,39.46 82.39,34.06 83.48,32.97 86.77,32.97 94.75,24.99 94.75,23.3
  Bottom 0.254: v13.74,36.61 13.74,42.8 12.69,43.85 12.69,47.13 | 12.87,47.52 12.87,47.34
ESP_VSPI_CS  (via drill 0.35)
  Top 0.254: v13.2,35.2 12.6,35.2 12.42,35.02 12.42,33.77 U2.29 | U4.SEL 31.77,19.02 26.87,23.92 26.87,29.95 25.55,31.27 14.87,31.27 14.72,31.11 v12.35,31.11
  Bottom 0.254: v12.35,31.11 12.35,32.2 13.05,32.9 13.05,35.06 v13.2,35.2
ESP_VSPI_MISO
  Top 0.254: HEADER_R.7 23.9,42.06 21.04,42.06 17.88,38.9 13.6,38.9 9.9,35.19 U2.31 9.99,33.66 9.99,33.3 10.85,32.43 27.48,32.43 34.89,25.02 U4.SDO
ESP_VSPI_MOSI
  Top 0.254: HEADER_R.2 13.96,44.53 12.3,42.87 10.72,42.87 2.27,34.43 U2.37 2.82,33.21 2.82,32.85 3.85,31.81 26.33,31.81 35.18,22.96 35.32,22.96 U4.SDI
ESP_VSPI_SCLK  (1 unrouted)
  Top 0.254: 35.42,21.07 U4.SCK 37.17,21.02 37.65,21.5 37.65,29.25 33.72,33.17 23.43,33.17 21.74,34.86 19.93,34.86 19.49,35.3 19.49,36.4 17.81,38.09 13.93,38.09 11.42,35.58 11.42,34.01 U2.30
GND  (via drill 0.35)  (10 unrouted)
  Top 0.254: PWR.C 88.68,7.14 88.18,6.63 88.18,4.87 POWER.2 | PROG.1 20.56,37.9 IO4_LED.C
  Top 0.508: U3.7 84.49,18.55 83.99,18.04
  Top 0.61: 98.14,22.57 98.04,22.57 U5.24 98.76,22.53 98.78,22.51 | C5.2 88.8,16.18 89.73,17.11
  Top 1.016: 98.78,22.51 C10.2 C9.2 | 98.74,22.51 98.78,22.51 | 98.78,22.51 98.78,22.57 98.43,22.92 | U4.GND 53.68,15.02 54.3,15.64 C11.2 C6.2 | U5.7 91.4,36 94.33,38.92 GPS_LOCK.C 94.47,43.68 H4.B3,2 | R5.1 R6.1 23.17,24.29 23.17,24.28 | U2.1 1,14.52 1.15,14.37 C4.2 C8.2 1.15,9 H2.B3,2 10.78,5.08 HEADER_L.1 | 35.45,13.02 U4.GND@2 35.42,12.98 37.43,12.98 | 50.39,2.4 LORA_U.FL.3 | U2.38 1,39.18 5.07,43.25 H1.B3,2 5.43,44.81 HEADER_R.1 | C3.2 6.93,11.34 v8.25,11.34 | C1.2 C2.2 75.14,16.02 U1.1 | MS621FE.- 89.24,15.6 C5.2 | U4.GND@1 35.13,27.27 35.13,28.85 | U2.15 21.04,19.04 21.05,19.03 | 89.71,15.31 89.71,19.18 U3.3 U3.4 | C9.2 98.81,18.55 | U5.13 83.17,21.7 v81.8,21.7 | H3.B3,2 98.63,8.47 98.63,18.43 C9.2
  other vias: 9.7,25.32 9.7,24.05 9.7,22.78 8.43,22.78 8.43,24.05 8.43,25.32 7.16,25.32 7.16,24.05 7.16,22.78 37.36,12.96 35.14,28.81 20.98,19.02 23.18,24.37 90.06,14.76 89.71,16.91 86.39,37.81 86.4,36 86.4,36.9 86.4,39.7 86.4,40.5 83.8,40.5 83.8,39.6 83.8,38.7 83.8,37.8 83.8,36.9 83.8,36 50.2,14 50.2,13.2 50.2,12.4 50.8,11.8 50.8,11 50.8,10.2 50.8,9.4 53.1,11.8 53.1,11 53.7,12.4 53.7,13.2 53.5,14 53.1,10.2 53.1,9.4 53.1,8.6 50.8,8.6 83.6,17.7 82.8,17.7 82,17.7 81.3,17.3 80.5,17.3 82.8,16.9 82,16.9 82,16.1 81.3,16.5 81.3,15.7 80.5,15.7 80.5,16.5
  pour Top (no thermals): 84,35.05 83.2,35.86 83.2,39.97 81.54,41.63 81.54,48.57 88.89,48.57 88.91,48.59 88.91,37.73 86.64,35.46 86.64,34.35 84.19,34.35
  pour Top (no thermals): 50.9,15.6 48.3,13 48.3,0.3 55.6,0.3 55.6,13 53,15.6
  pour Top (no thermals): 76.19,15.24 83.81,15.24 83.81,19.05 81.05,19.05 79.2,17.2 76.88,17.2 76.19,16.51
  pour Bottom (no thermals): 97.46,49.2 2.23,49.2 -0.31,46.66 -0.31,2.24 2.23,-0.3 97.46,-0.3 100,2.24 100,46.66
GPS_RF_IN  (1 unrouted)
  Top 1.016: U5.11 GPS_ANT.1 GPS_U.FL.2
GPS_SCL2
  Top 0.254: U3.6 87.74,19.2 89.61,21.06 92.32,21.06 92.5,21.25 U5.19
GPS_SDA2
  Top 0.254: U5.18 90.34,22.53 87.65,19.84 U3.5
GPS_TIMEPULSE
  Top 0.254: R8.1 97.23,37.15 95.8,35.73 U5.3
GPS_VCC_RF  (1 unrouted)
  Top 0.61: R7.1 90.43,36.56 U5.8
LORA_ANT
  Top 1.016: U4.ANT LORA_ANT.1 | LORA_ANT.1 LORA_U.FL.2 LORA_ANT.1
N$2
  Top 1.016: POWER.1 84.52,14.5 D1.A
N$5
  Top 0.254: R3.1 20.22,33.81 IO4_LED.A
N$10
  Top 0.254: PWR.A R4.1
N$14
  Top 0.254: R8.2 96.69,39.05 GPS_LOCK.A
N$16
  Top 0.61: L1.2 R7.2
N$17
  Top 0.254: R10.2 92.48,18.96 D2.C
V_BCKP  (1 unrouted)
  Top 0.254: U5.22 95.55,22.27 95.55,20.83 94.31,19.6 94.31,13.86 92.76,12.31 MS621FE.+